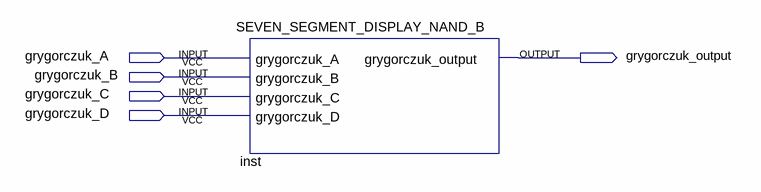
[diagram p0: schematic sheet]
// Quartus schematic SEVEN_SEGMENT_DISPLAY_NAND_B_SYMBOL.bdf as structural Verilog: 1 symbols, 5 pins
module SEVEN_SEGMENT_DISPLAY_NAND_B_SYMBOL (
  input  grygorczuk_A,
  input  grygorczuk_B,
  input  grygorczuk_C,
  input  grygorczuk_D,
  output grygorczuk_output
);

  SEVEN_SEGMENT_DISPLAY_NAND_B inst (
    .grygorczuk_A(grygorczuk_A), .grygorczuk_B(grygorczuk_B), .grygorczuk_C(grygorczuk_C),
    .grygorczuk_D(grygorczuk_D), .grygorczuk_output(grygorczuk_output));
endmodule
